# Altium schematic sheet tlv117_5_3.3.SchDoc
size A4
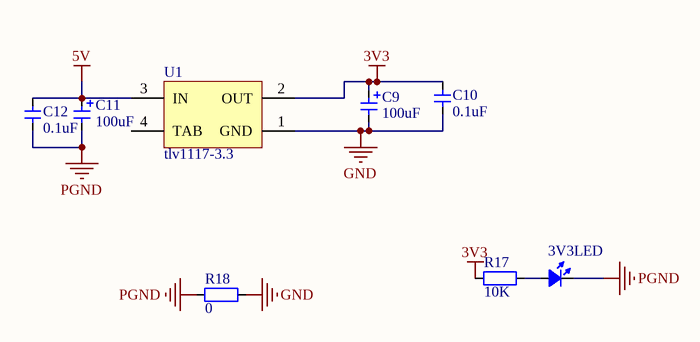
[diagram p0: tlv117_5_3.3.SchDoc]

## Parts
3V3LED  LED_0805  [LED_0805_BLUE]  (value not drawn)
C9  value 100uF  [CAP-TAN-6032/CAPC]  (hidden comment: Cap_Tan_0805)
C10  value 0.1uF  [CAP_0603]  (hidden comment: Cap_0603)
C11  value 100uF  [CAP-TAN-6032/CAPC]  (hidden comment: Cap_Tan_0805)
C12  value 0.1uF  [CAP_0603]  (hidden comment: Cap_0603)
R17  value 10K  [RES_0603]  (hidden comment: Res_0603)
R18  value 0  [RES_0603]  (hidden comment: Res_0603)
U1  tlv1117-3.3  [SOT223-3]

## Nets
3V3: C9.1 C10.2 R17.1 U1.2(OUT)
5V: C11.1 C12.2 U1.3(IN)
GND: C9.2 C10.1 R18.2 U1.1(GND)
PGND: 3V3LED.2(K) C11.2 C12.1 R18.1
Net3V3LED_1: 3V3LED.1(A) R17.2

Not connected (* = marked no-connect by the designer): U1 4(TAB)

## Library data of the parts
3V3LED = LED_0603: LED
C9 C11 = Cap_Tan_0805: Capacitor
C10 C12 = Cap_0603: Capacitor
R17 R18 = Res_0603: Resistor
U1 = LM1117IMP-5.0: 800mA Low-Dropout Linear Regulator; Manufacturer: National Semiconductor; CompType: LDO IC; PackageTopMarking: XYTT*N06B; PowerWise: N; Published: 4-Dec-2008; DatasheetVersion: Apr-2006; PackageVersion: revB, Apr-2003; PackageReference: MP04A; Publisher: Altium Limited; PackageDescription: Molded SOT-223, 6.50 x 3.56 x 1.6mm Body, 4 Lead, 2.3mm Pitch; PartNumber: LM1117IMP-5.0; RoHS: O; PinCount: 4; DigiKeyPartNumber: LM1117IMP-5.0CT-ND; Code_JEDEC: TO-261-AA; Code_IPC: SOT223-4; ComponentLink1Description: LM1117 Datasheet; ComponentLink1URL: http://www.national.com/ds/LM/LM1117.pdf; ComponentLink2Description: LM1117 Web Page; ComponentLink2URL: http://www.national.com/pf/LM/LM1117.html; ComponentLink3Description: MP04A Package Page; ComponentLink3URL: http://www.national.com/packaging/folders/mp04a.html